# EAGLE design solar (EAGLE 6.5.0)
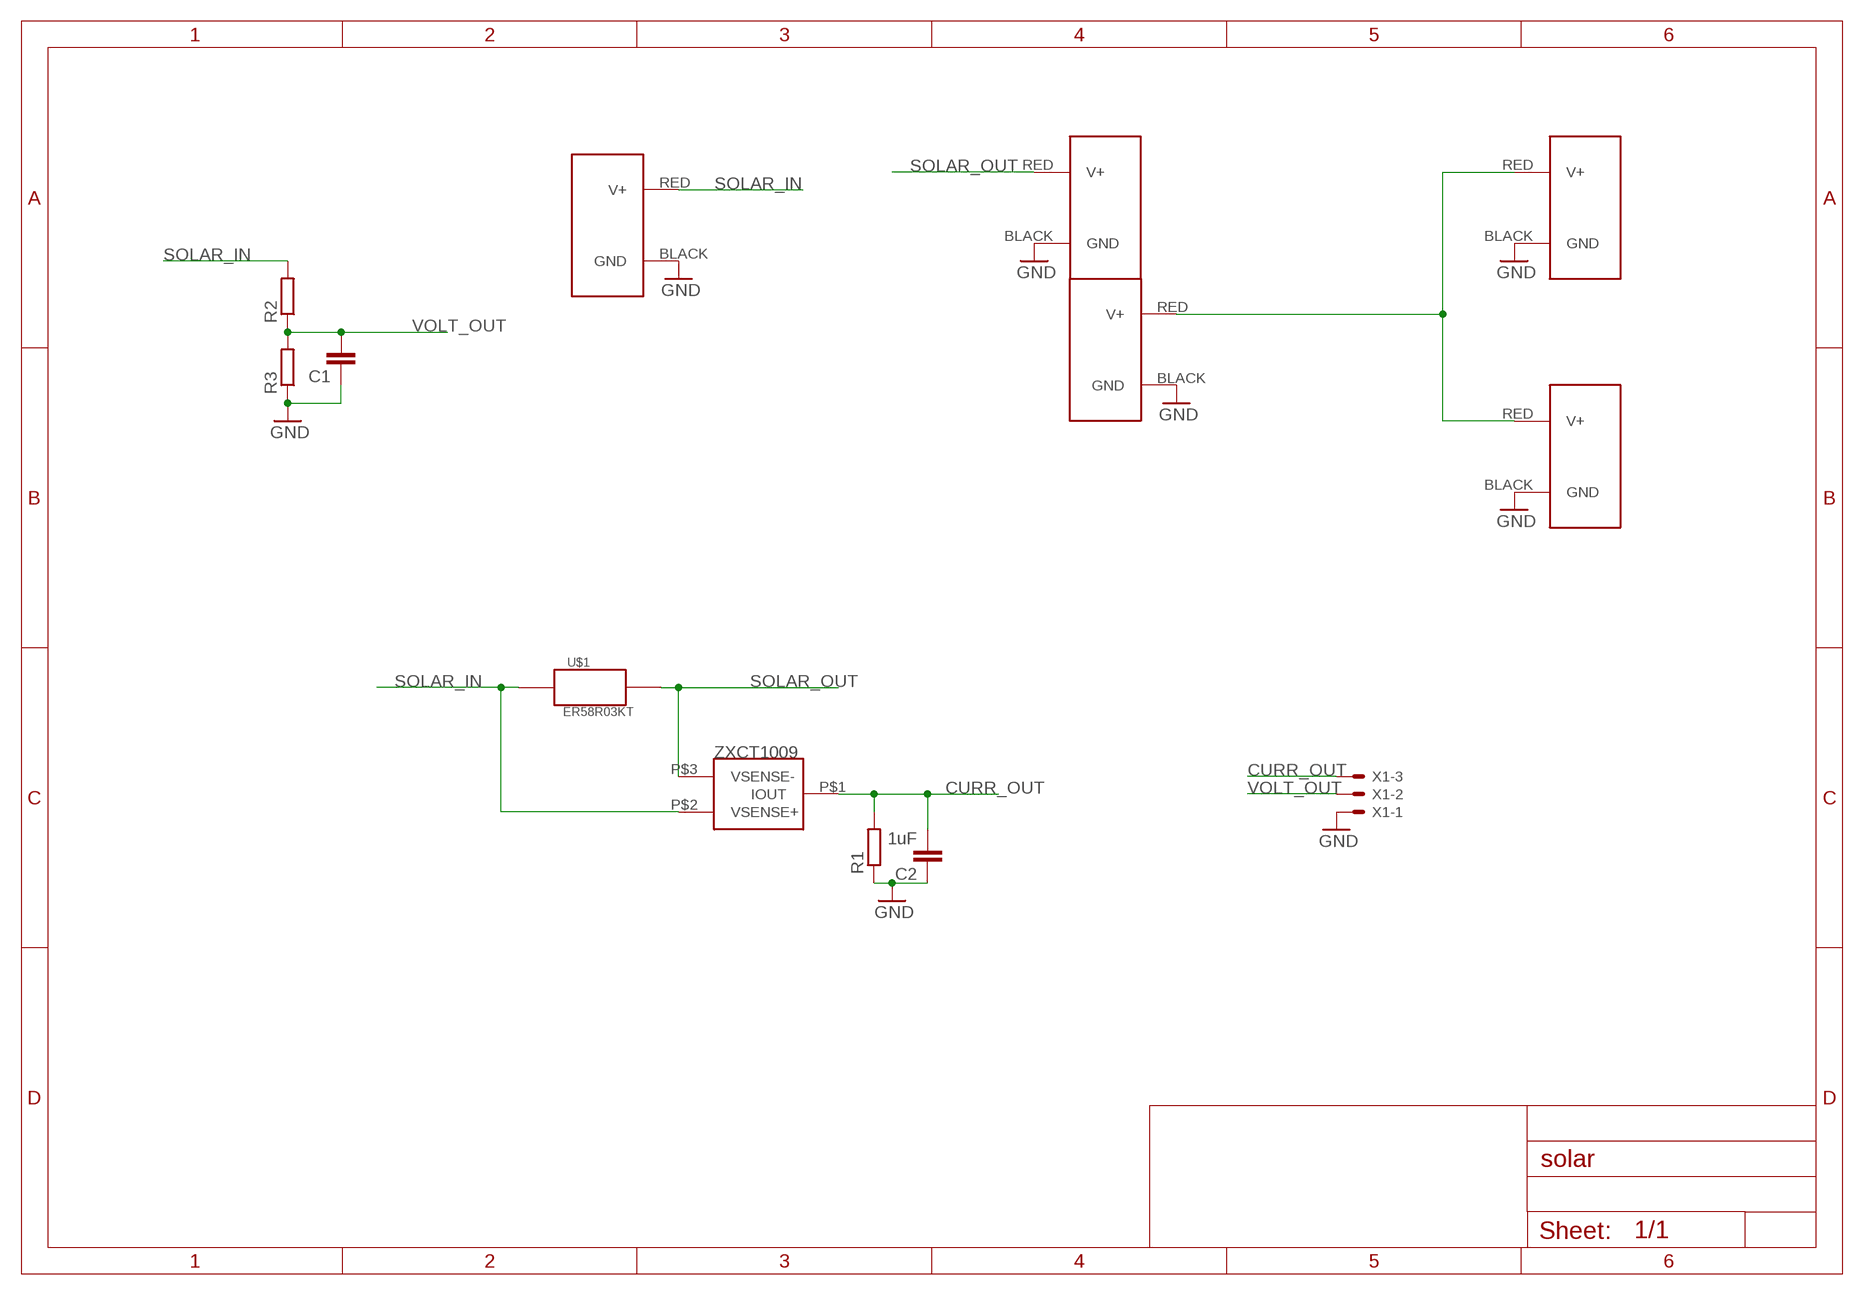
[diagram p0: schematic, sheet 1]

## Parts
C1  C-EUC0805  [C0805]
C2  1uF  C-EUC0805  [C0805]
J1  POWERPOLE_POWER25A  [POWERPOLE_PAIR_25A]
J2  POWERPOLE_POWER25A  [POWERPOLE_PAIR_25A]
J3  POWERPOLE_POWER25A  [POWERPOLE_PAIR_25A]
J4  POWERPOLE_POWER25A  [POWERPOLE_PAIR_25A]
J5  POWERPOLE_POWER25A  [POWERPOLE_PAIR_25A]
R1  R-EU_R0805  [R0805]
R2  R-EU_R0805  [R0805]
R3  R-EU_R0805  [R0805]
U$1  ER58R03KT  [ER58R03KT]
U$2  ZXCT1009  [ZXCT1009-SOT]
X1  KK-156-3  [KK-156-3]

## Nets
CURR_OUT: C2.2 R1.2 U$2.P$1(IOUT) X1.3
GND: C1.1 C2.1 J1.BLACK(GND) J2.BLACK(GND) J3.BLACK(GND) J4.BLACK(GND) J5.BLACK(GND) R1.1 R3.1 X1.1
N$1: J2.RED(V+) J4.RED(V+) J5.RED(V+)
SOLAR_IN: J1.RED(V+) R2.2 U$1.P$1 U$2.P$2(VSENSE+)
SOLAR_OUT: J3.RED(V+) U$1.P$2 U$2.P$3(VSENSE-)
VOLT_OUT: C1.2 R2.1 R3.2 X1.2

## Library data of the parts
C1 C2 = rcl:C-EU: CAPACITOR, European symbol
J1-J5 = powerpoles:POWERPOLE_POWER: Anderson Powerpole Power Connector using ameteur radio standard layout
R1-R3 = rcl:R-EU_: RESISTOR, European symbol
U$1 = power:ER58R03KT
U$2 = power:ZXCT1009
X1 = con-molex:KK-156-3: KK 156 HEADER Source: http://www.molex.com/pdm_docs/sd/026604100_sd.pdf; OC_FARNELL: unknown; OC_NEWARK: unknown

## Board
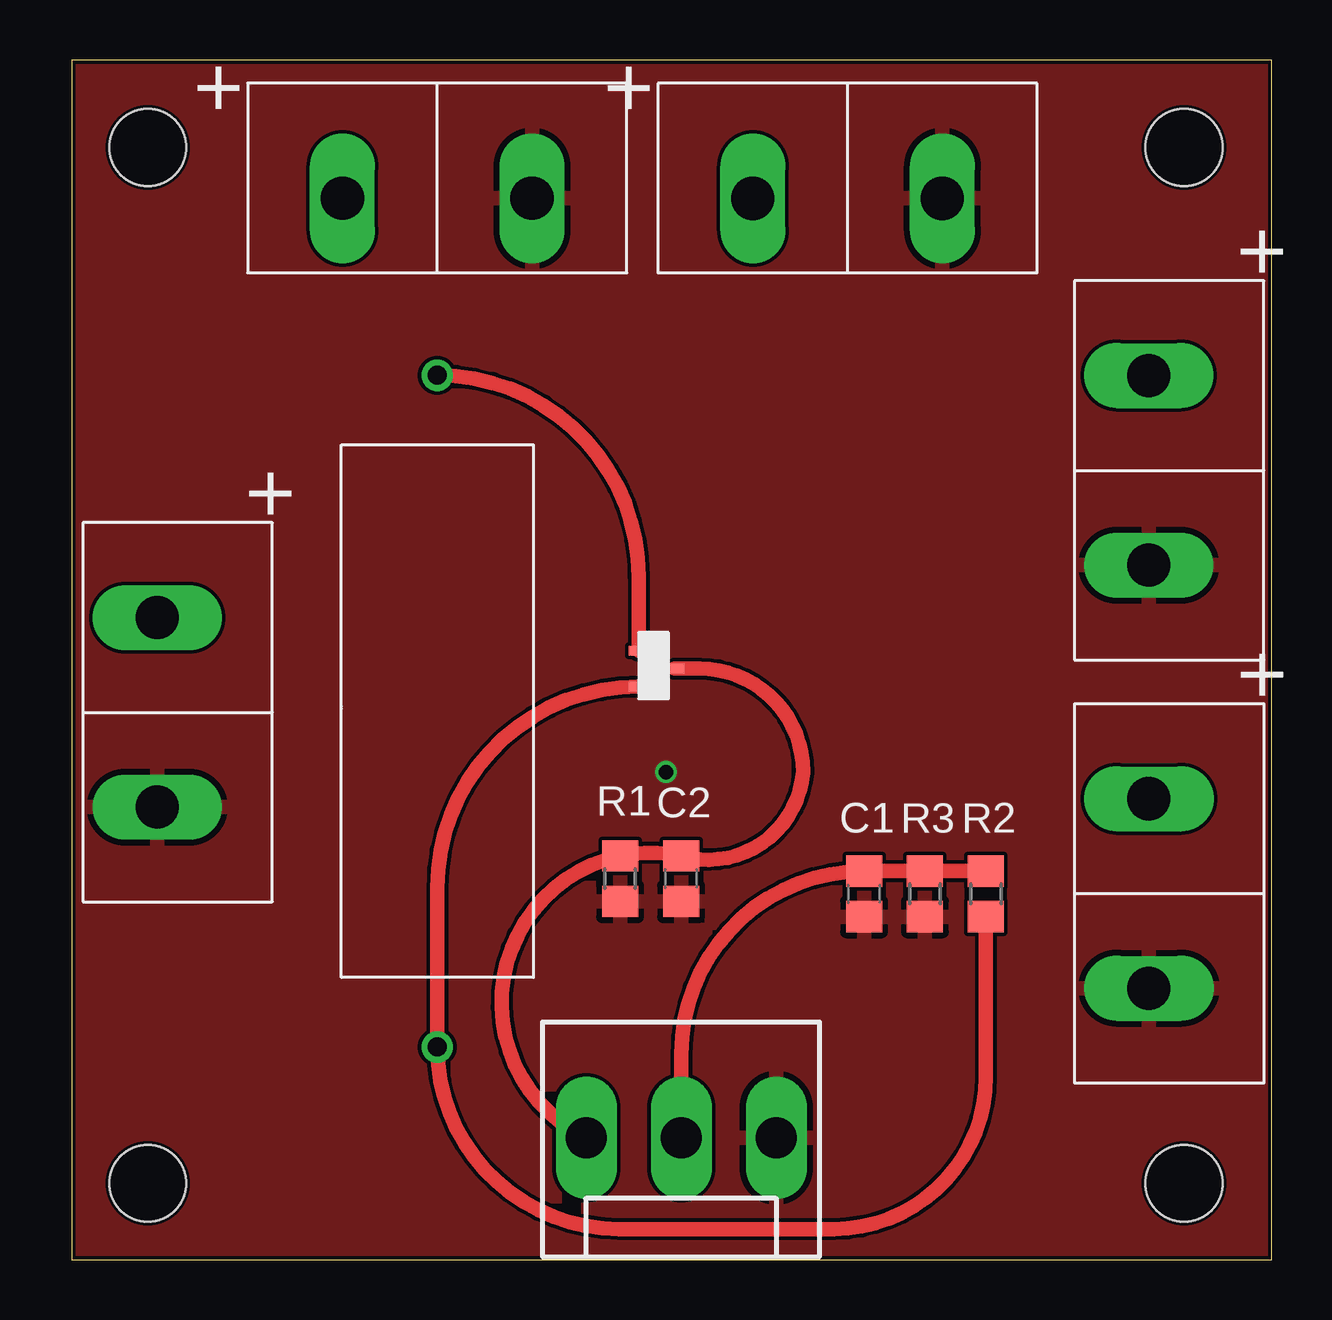
[diagram p1: board, top side]
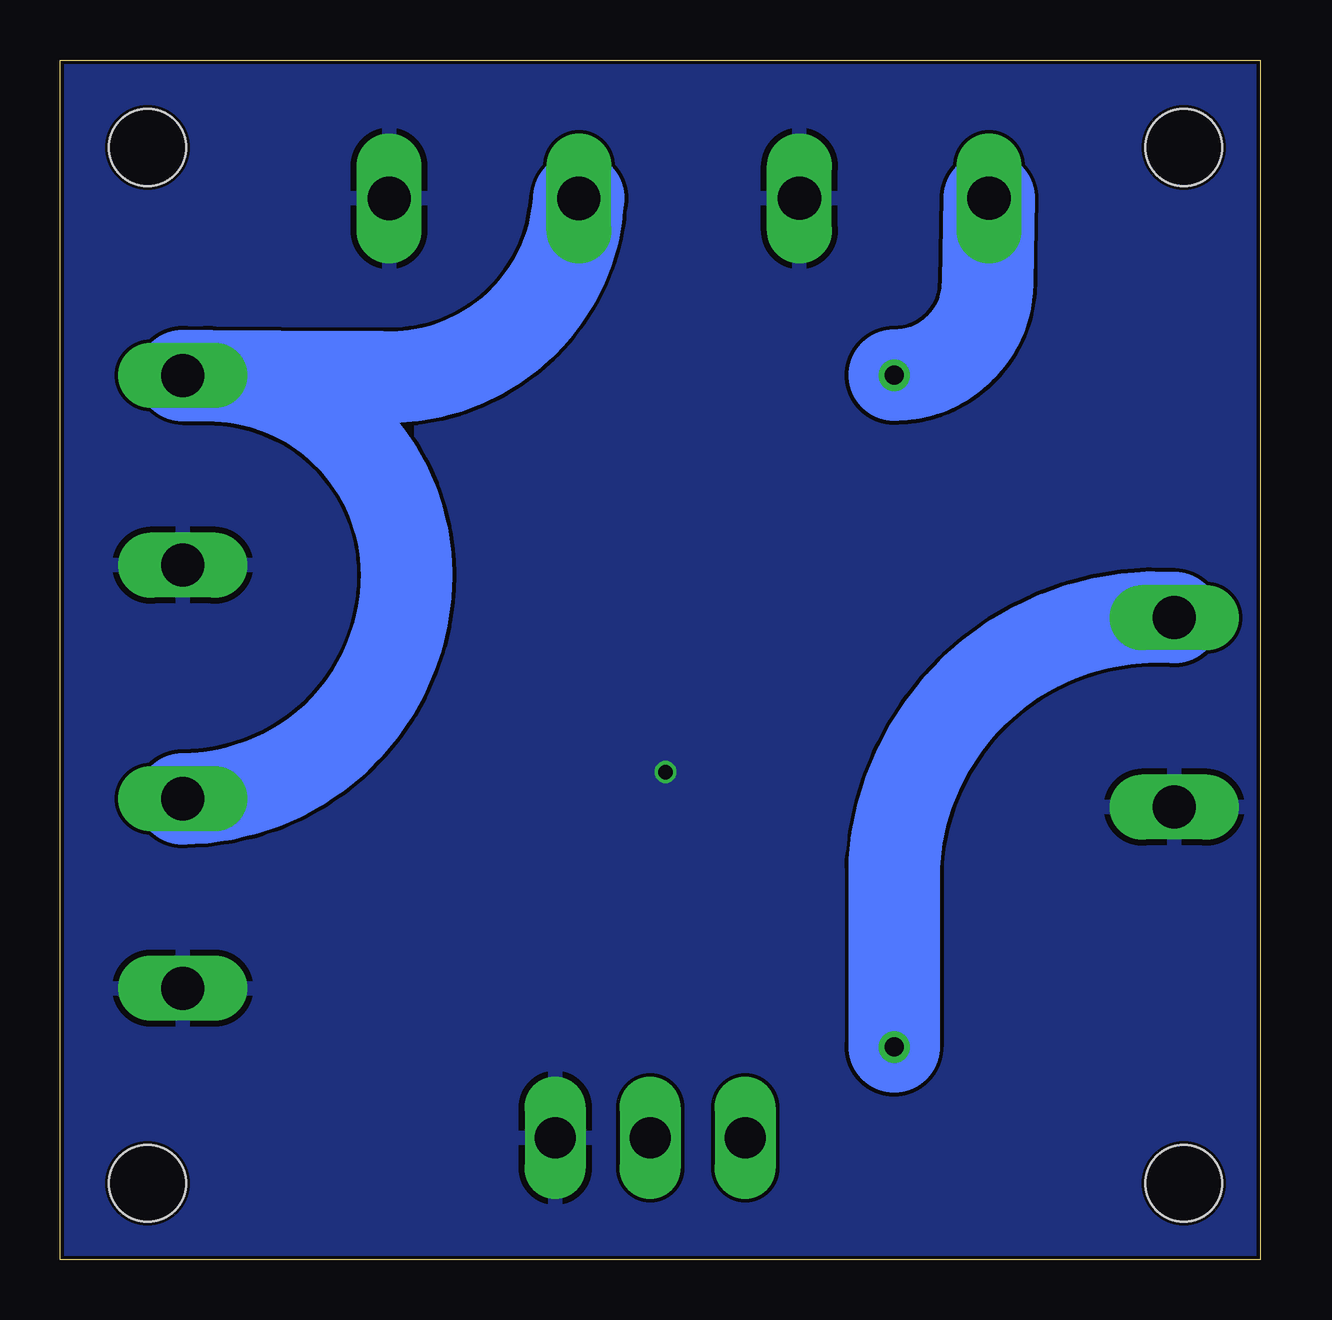
[diagram p2: board, bottom side, seen from below]

Size 50 x 50 mm. Coordinates in mm from the lower left corner, seen from the top.
Outline: 0,0 50,0 50,50 0,50 0,0
Copper layers (1*16): Top 0.035mm / dielectric 1.5mm / Bottom 0.035mm
Design rules "Hackvana": minimum track width 6mil, minimum drill 0.3mm, track to track 6mil, track to pad 6mil, pad to pad 6mil, via to via 6mil, smd to smd 0mil, copper to edge 6mil, drill to drill 6mil, minimum pad ring 10mil, minimum via ring 6mil, stop-mask expansion 2mil, vias tented up to drill 100mil, thermal gap 10mil
Holes 3.2 mm at 3.17,46.35 3.17,3.17 46.35,3.17 46.35,46.35

### Footprints (pad centres in the part's own frame; a part is rotated, then mirrored left to right if it is on the bottom)
C0805 = smd 1.3 x 1.5: 1 -0.95,0; 2 0.95,0
POWERPOLE_PAIR_25A = drill 1.8 long: BLACK 3.95,-0.85; RED -3.95,-0.85
R0805 = smd 1.3 x 1.5: 1 -0.95,0; 2 0.95,0
ER58R03KT = drill 0.8: P$1 -14,0; P$2 14,0
ZXCT1009-SOT = smd 0.813 x 0.406: P$1 -1,-0.5; P$2 0.5,0.25; P$3 0.5,-1.25
KK-156-3 = drill 1.7 pad 2.184 long: 1 -3.96,0; 2 0,0; 3 3.96,0

### Placement (x,y rotation side)
C1  33.02,15.24 90 top
C2  25.4,15.88 90 top
J1  4.42,22.81 270 top
J2  45.74,15.26 270 top
J3  15.24,45.09 0 top
J4  45.73,32.89 270 top
J5  32.33,45.08 0 top
R1  22.86,15.88 90 top
R2  38.1,15.24 270 top
R3  35.56,15.24 90 top
U$1  15.24,22.86 90 top
U$2  24.13,24.13 180 top
X1  25.41,5.07 180 top

### Tracks (layer width: path | path; a pad name or v marks a point on that pad's centre or on a via)
CURR_OUT
  Top 0.61: U$2.P$1 26.17,24.63 arc-90 30.48,20.32 arc-102 C2.2 arc24 R1.2 arc142 X1.3
GND  (via drill 0.6)
  other vias: 24.77,20.32
  pour Bottom: -3.17,53.34 -3.17,-3.81 53.34,-3.81 53.34,53.34 -2.54,53.34
  pour Top: -1.27,51.44 52.07,51.44 52.07,-1.91 -1.27,-1.91
N$1
  Bottom 3.81: J5.RED arc90 36.72,36.8 J4.RED 43.83,36.84 arc90 35.56,28.57 35.56,28.54 arc90 J2.RED
SOLAR_IN
  Top 0.61: U$2.P$2 arc90 15.24,15.49 U$1.P$1 arc90 22.83,1.27 31.75,1.27 arc90 38.1,7.62 R2.2
  Bottom 3.81: J1.RED arc-90 15.24,16.52 U$1.P$1
SOLAR_OUT
  Top 0.61: U$1.P$2 arc-90 23.63,28.47 U$2.P$3
  Bottom 3.81: U$1.P$2 arc-90 11.34,40.76 J3.RED
VOLT_OUT
  Top 0.61: X1.2 25.41,8.58 arc-90 C1.2 R3.2 R2.1

### Text on the board
tDocu: REG OUT | REG IN | SOLAR IN | BATT | LOAD | SENSE OUT | SOLAR V0.1 | PJB